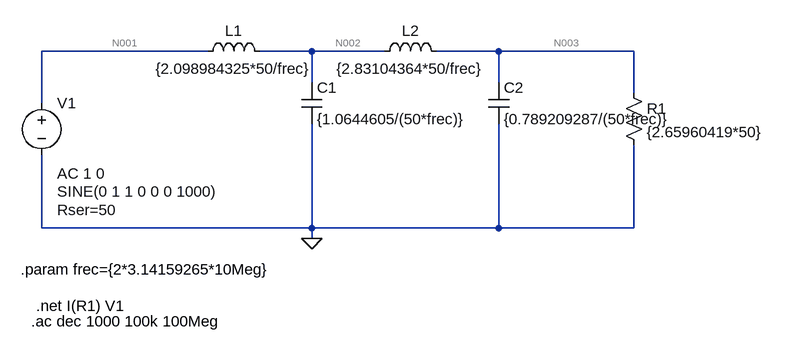
[diagram p0: schematic ts15.asc]
ts15.asc, the LTspice schematic file:
Version 4
SHEET 1 972 680
WIRE 80 -96 -176 -96
WIRE 240 -96 160 -96
WIRE 352 -96 240 -96
WIRE 528 -96 432 -96
WIRE 736 -96 528 -96
WIRE 240 -48 240 -96
WIRE 528 -48 528 -96
WIRE 736 -32 736 -96
WIRE -176 -16 -176 -96
WIRE -176 176 -176 64
WIRE 240 176 240 16
WIRE 240 176 -176 176
WIRE 528 176 528 16
WIRE 528 176 240 176
WIRE 736 176 736 48
WIRE 736 176 528 176
WIRE 240 192 240 176
FLAG 240 192 0
SYMBOL voltage -176 -32 R0
WINDOW 3 24 152 Left 2
WINDOW 123 24 124 Left 2
WINDOW 39 24 180 Left 2
SYMATTR Value SINE(0 1 1 0 0 0 1000)
SYMATTR Value2 AC 1 0
SYMATTR SpiceLine Rser=50
SYMATTR InstName V1
SYMBOL ind 64 -80 R270
WINDOW 0 32 56 VTop 2
WINDOW 3 5 56 VBottom 2
SYMATTR InstName L1
SYMATTR Value {2.098984325*50/frec}
SYMBOL cap 224 -48 R0
SYMATTR InstName C1
SYMATTR Value {1.0644605/(50*frec)}
SYMBOL ind 336 -80 R270
WINDOW 0 32 56 VTop 2
WINDOW 3 5 56 VBottom 2
SYMATTR InstName L2
SYMATTR Value {2.83104364*50/frec}
SYMBOL res 720 -48 R0
SYMATTR InstName R1
SYMATTR Value {2.65960419*50}
SYMBOL cap 512 -48 R0
SYMATTR InstName C2
SYMATTR Value {0.789209287/(50*frec)}
TEXT -184 296 Left 2 !.net I(R1) V1
TEXT -192 320 Left 2 !.ac dec 1000 100k 100Meg
TEXT -208 240 Left 2 !.param frec={2*3.14159265*10Meg}

The netlist it stands for:
* ts15.asc
V1 N001 0 SINE(0 1 1 0 0 0 1000) AC 1 0 Rser=50
L1 N001 N002 {2.098984325*50/frec}
C1 N002 0 {1.0644605/(50*frec)}
L2 N002 N003 {2.83104364*50/frec}
R1 N003 0 {2.65960419*50}
C2 N003 0 {0.789209287/(50*frec)}
.net I(R1) V1
.ac dec 1000 100k 100Meg
.param frec={2*3.14159265*10Meg}
.backanno
.end

* Results of the author's LTspice run, read from the files saved beside the schematic
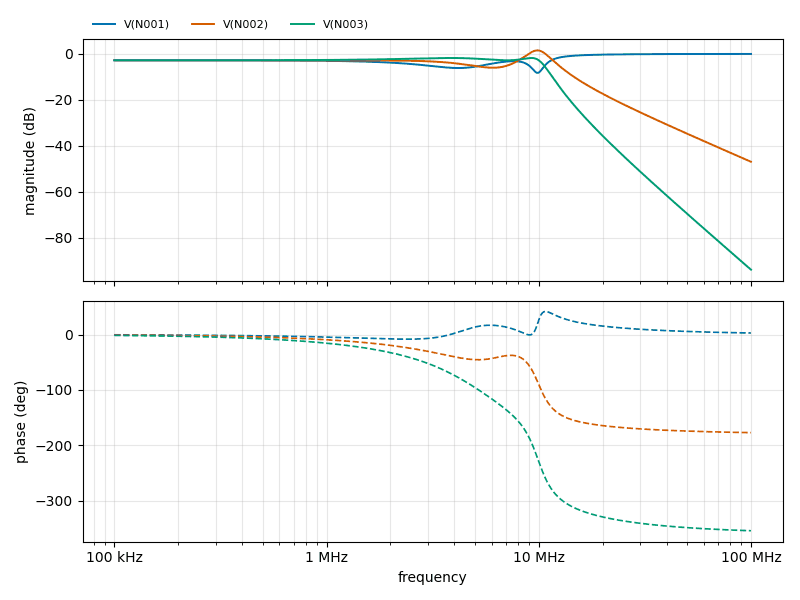
[diagram p1: AC Analysis of ts15.asc, plotted from the saved traces]
* AC Analysis, 1 run:
*   V(N001): -2.77 dB at 100 kHz, -0.01 dB at 100 MHz, peak -0.01 dB at 100 MHz, 3 dB below the peak at 11.34 MHz
*   V(N002): -2.77 dB at 100 kHz, -46.92 dB at 100 MHz, peak 1.52 dB at 9.84 MHz, 3 dB below the peak at 8.468 MHz and 11.23 MHz
*   V(N003): -2.77 dB at 100 kHz, -93.88 dB at 100 MHz, peak -1.77 dB at 3.828 MHz, 3 dB below the peak at 10.53 MHz